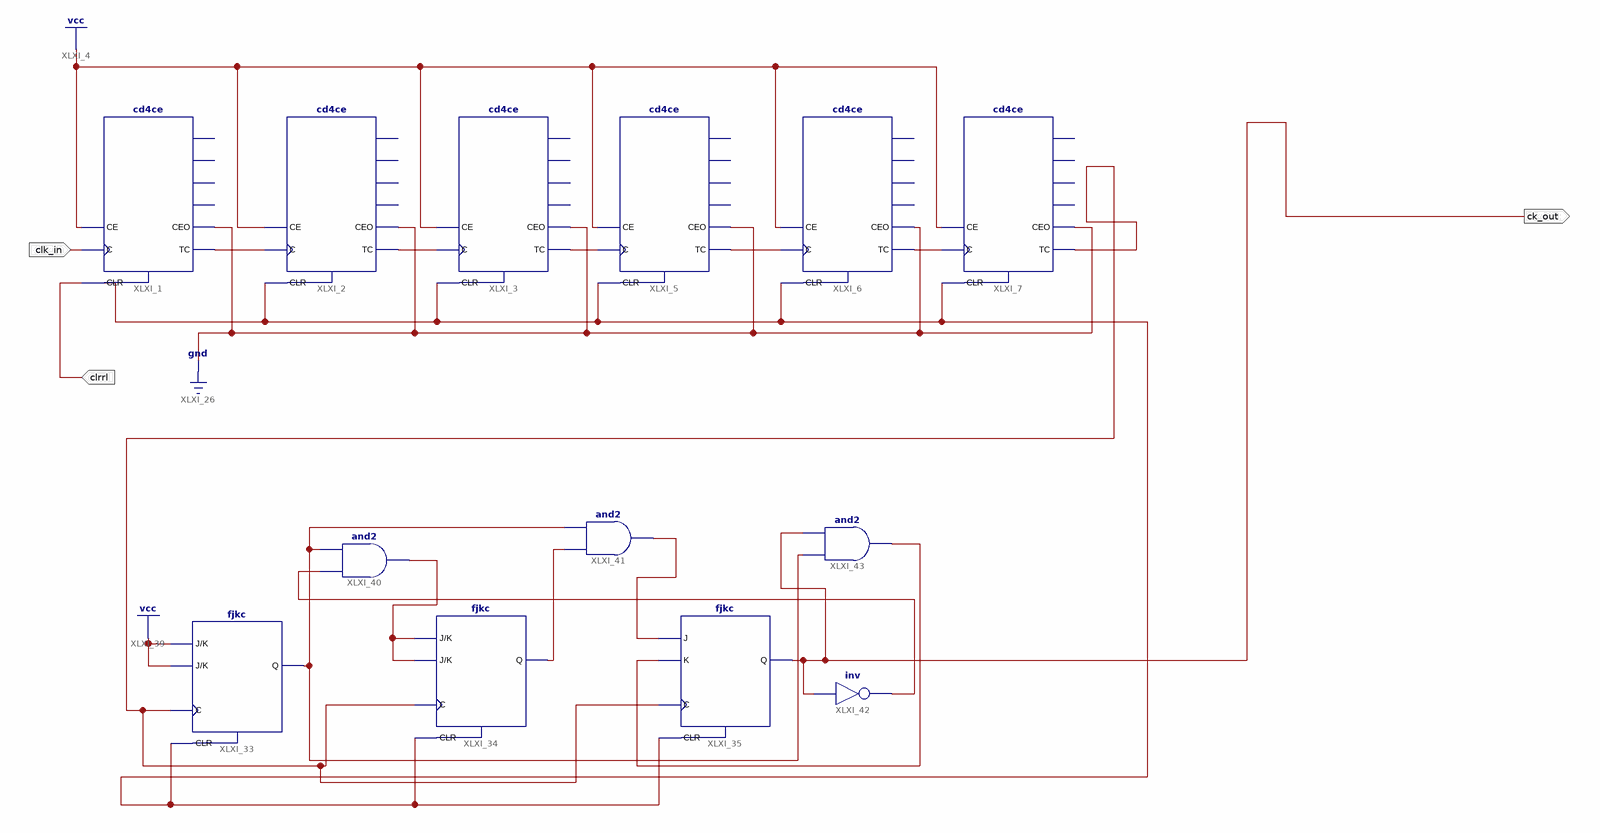
[diagram p0: schematic sheet 1]
// Xilinx ISE schematic samrong.sch (spartan6) as structural Verilog: 13 symbols, 3 ports
module samrong (
  input  clk_in,
  input  clrrl,
  output ck_out
);

  wire XLXN_1, XLXN_2, XLXN_4, XLXN_5, XLXN_6, XLXN_96, XLXN_105, XLXN_106, XLXN_108, XLXN_109, XLXN_110,
       XLXN_111;

  cd4ce XLXI_1 (.C(clk_in), .CE(1'b1), .CLR(clrrl), .CEO(1'b0), .TC(XLXN_1));  // open: Q0, Q1, Q2, Q3
  cd4ce XLXI_2 (.C(XLXN_1), .CE(1'b1), .CLR(clrrl), .CEO(1'b0), .TC(XLXN_2));  // open: Q0, Q1, Q2, Q3
  cd4ce XLXI_3 (.C(XLXN_2), .CE(1'b1), .CLR(clrrl), .CEO(1'b0), .TC(XLXN_4));  // open: Q0, Q1, Q2, Q3
  cd4ce XLXI_5 (.C(XLXN_4), .CE(1'b1), .CLR(clrrl), .CEO(1'b0), .TC(XLXN_5));  // open: Q0, Q1, Q2, Q3
  cd4ce XLXI_6 (.C(XLXN_5), .CE(1'b1), .CLR(clrrl), .CEO(1'b0), .TC(XLXN_6));  // open: Q0, Q1, Q2, Q3
  cd4ce XLXI_7 (.C(XLXN_6), .CE(1'b1), .CLR(clrrl), .CEO(1'b0), .TC(XLXN_96));  // open: Q0, Q1, Q2, Q3
  fjkc XLXI_33 (.C(XLXN_96), .CLR(clrrl), .J(1'b1), .K(1'b1), .Q(XLXN_109));
  fjkc XLXI_34 (.C(XLXN_96), .CLR(clrrl), .J(XLXN_106), .K(XLXN_106), .Q(XLXN_108));
  fjkc XLXI_35 (.C(XLXN_96), .CLR(clrrl), .J(XLXN_110), .K(XLXN_111), .Q(ck_out));
  and XLXI_41 (XLXN_110, XLXN_108, XLXN_109);
  and XLXI_40 (XLXN_106, XLXN_105, XLXN_109);
  not XLXI_42 (XLXN_105, ck_out);
  and XLXI_43 (XLXN_111, XLXN_109, ck_out);
endmodule
